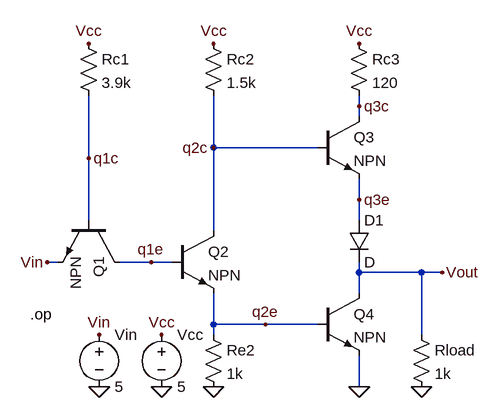
[diagram p0: schematic PL2.asc]
PL2.asc, the LTspice schematic file:
Version 4
SHEET 1 880 680
WIRE 512 -64 512 -80
WIRE 512 -48 512 -64
WIRE 288 0 288 -80
WIRE 448 0 288 0
WIRE 96 16 96 -80
WIRE 512 80 512 48
WIRE 96 112 96 16
WIRE 512 112 512 80
WIRE 288 128 288 0
WIRE 48 176 32 176
WIRE 192 176 144 176
WIRE 224 176 192 176
WIRE 512 192 512 176
WIRE 608 192 512 192
WIRE 640 192 608 192
WIRE 512 224 512 192
WIRE 288 272 288 224
WIRE 368 272 288 272
WIRE 448 272 368 272
WIRE 288 288 288 272
WIRE 608 288 608 192
WIRE 512 368 512 320
FLAG 208 288 Vcc
FLAG 112 288 Vin
FLAG 112 368 0
FLAG 208 368 0
FLAG 96 -160 Vcc
FLAG 288 -160 Vcc
FLAG 512 -160 Vcc
FLAG 32 176 Vin
FLAG 288 368 0
FLAG 512 368 0
FLAG 608 368 0
FLAG 640 192 Vout
FLAG 512 80 q3e
FLAG 288 0 q2c
FLAG 96 16 q1c
FLAG 192 176 q1e
FLAG 368 272 q2e
FLAG 512 -64 q3c
SYMBOL res 80 -176 R0
SYMATTR InstName Rc1
SYMATTR Value 3.9k
SYMBOL res 272 -176 R0
SYMATTR InstName Rc2
SYMATTR Value 1.5k
SYMBOL res 496 -176 R0
SYMATTR InstName Rc3
SYMATTR Value 120
SYMBOL res 272 272 R0
SYMATTR InstName Re2
SYMATTR Value 1k
SYMBOL res 592 272 R0
SYMATTR InstName Rload
SYMATTR Value 1k
SYMBOL voltage 112 272 R0
WINDOW 123 0 0 Left 0
WINDOW 39 0 0 Left 0
SYMATTR InstName Vin
SYMATTR Value 5
SYMBOL voltage 208 272 R0
WINDOW 123 0 0 Left 0
WINDOW 39 0 0 Left 0
SYMATTR InstName Vcc
SYMATTR Value 5
SYMBOL npn 144 112 R90
SYMATTR InstName Q1
SYMBOL npn 224 128 R0
SYMATTR InstName Q2
SYMBOL npn 448 -48 R0
SYMATTR InstName Q3
SYMBOL npn 448 224 R0
SYMATTR InstName Q4
SYMBOL diode 496 112 R0
SYMATTR InstName D1
TEXT 6 256 Left 2 !.op

The netlist it stands for:
* PL2.asc
Rc1 Vcc q1c 3.9k
Rc2 Vcc q2c 1.5k
Rc3 Vcc q3c 120
Re2 q2e 0 1k
Rload Vout 0 1k
Vin Vin 0 5
Vcc Vcc 0 5
Q1 q1e q1c Vin 0 NPN
Q2 q2c q1e q2e 0 NPN
Q3 q3c q2c q3e 0 NPN
Q4 Vout q2e 0 0 NPN
D1 q3e Vout D
.model D D
.lib standard.dio
.model NPN NPN
.model PNP PNP
.lib standard.bjt
.op
.backanno
.end

* Results of the author's LTspice run, read from the files saved beside the schematic
* Operating Point:
*   V(vcc) = 5 V
*   V(q1c) = 2.403 V
*   V(q2c) = 859.1 mV
*   V(q3c) = 5 V
*   V(q2e) = 822.2 mV
*   V(vout) = 17.86 mV
*   V(vin) = 5 V
*   V(q1e) = 1.64 V
*   V(q3e) = 379 mV
*   Ic(Q4) = -17.84 µA
*   Ib(Q4) = 3.27 mA
*   Ie(Q4) = -3.252 mA
*   Ic(Q3) = 11.49 nA
*   Ib(Q3) = 111.2 pA
*   Ie(Q3) = -11.61 nA
*   Ic(Q2) = 2.761 mA
*   Ib(Q2) = 1.332 mA
*   Ie(Q2) = -4.092 mA
*   Ic(Q1) = -1.332 mA
*   Ib(Q1) = 665.8 µA
*   Ie(Q1) = 665.8 µA
*   I(D1) = 11.61 nA
*   I(Rload) = 17.86 µA
*   I(Re2) = 822.2 µA
*   I(Rc3) = 11.49 nA
*   I(Rc2) = 2.761 mA
*   I(Rc1) = 665.8 µA
*   I(Vcc) = -3.426 mA
*   I(Vin) = -665.8 µA
* From the log:
*   Semiconductor Device Operating Points:
*                           --- Diodes ---
*   Name:      d1
*   Model:      d
*   Id:      1.16e-08
*   Vd:      3.61e-01
*   Req:     2.23e+06
*   CAP:     0.00e+00
*                           --- Bipolar Transistors ---
*   Name:       q4          q3          q2          q1
*   Model:      npn         npn         npn         npn
*   Ib:       3.27e-03    1.11e-10    1.33e-03    6.66e-04
*   Ic:      -1.78e-05    1.15e-08    2.76e-03   -1.33e-03
*   Vbe:      8.22e-01    4.80e-01    8.17e-01   -2.60e+00
*   Vbc:      8.04e-01   -4.14e+00    7.81e-01    7.64e-01
*   Vce:      1.79e-02    4.62e+00    3.69e-02   -3.36e+00
*   BetaDC:  -5.46e-03    1.03e+02    2.07e+00   -2.00e+00
*   Gm:       1.23e-01    4.44e-07    1.56e-01   -2.57e-02
*   Rpi:      4.05e+02    2.25e+08    4.86e+02    1.00e+12
*   Rx:       0.00e+00    0.00e+00    0.00e+00    0.00e+00
*   Ro:       8.07e+00    8.75e+83    2.02e+01    3.88e+01
*   Cbe:      0.00e+00    0.00e+00    0.00e+00    0.00e+00
*   Cbc:      0.00e+00    0.00e+00    0.00e+00    0.00e+00
*   Cjs:      0.00e+00    0.00e+00    0.00e+00    0.00e+00
*   BetaAC:   4.99e+01    1.00e+02    7.60e+01   -2.57e+10
*   Cbx:      0.00e+00    0.00e+00    0.00e+00    0.00e+00
*   Ft:       0.00e+00    0.00e+00    0.00e+00    0.00e+00